# EAGLE board AlarmSt (EAGLE 4.16)
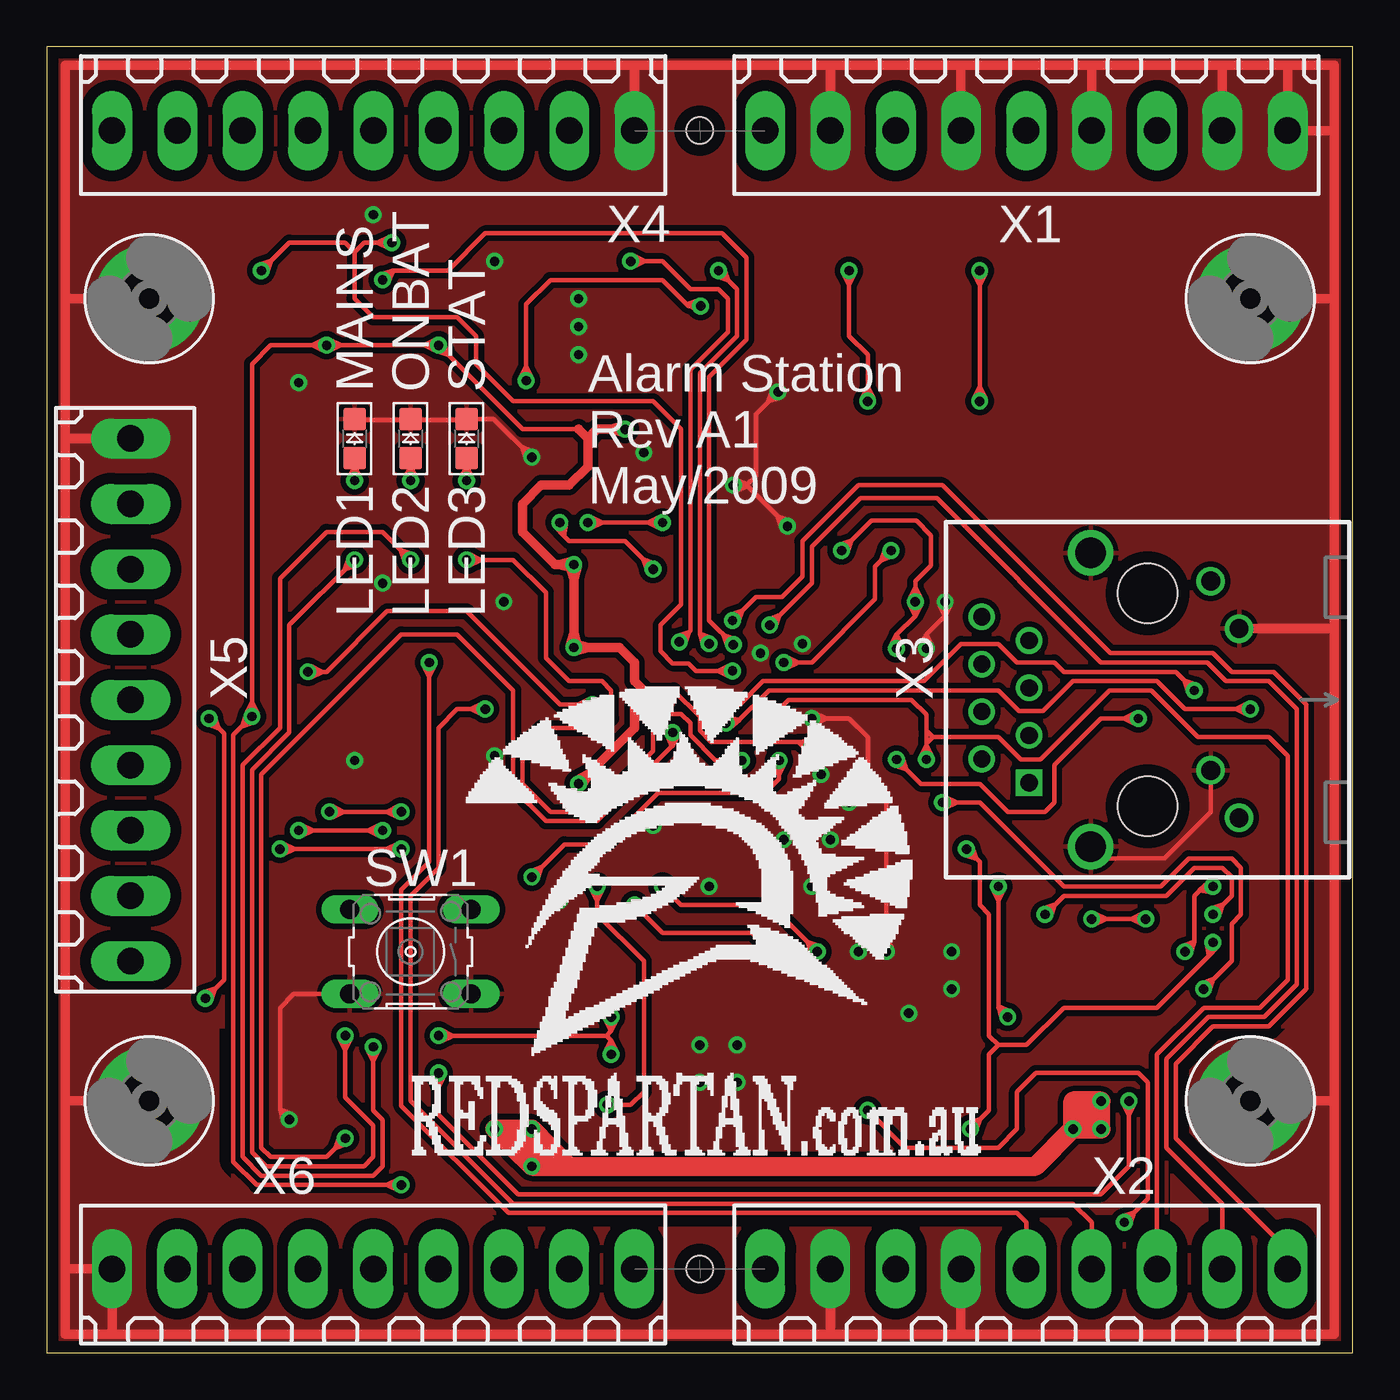
[diagram p4: board, top side]
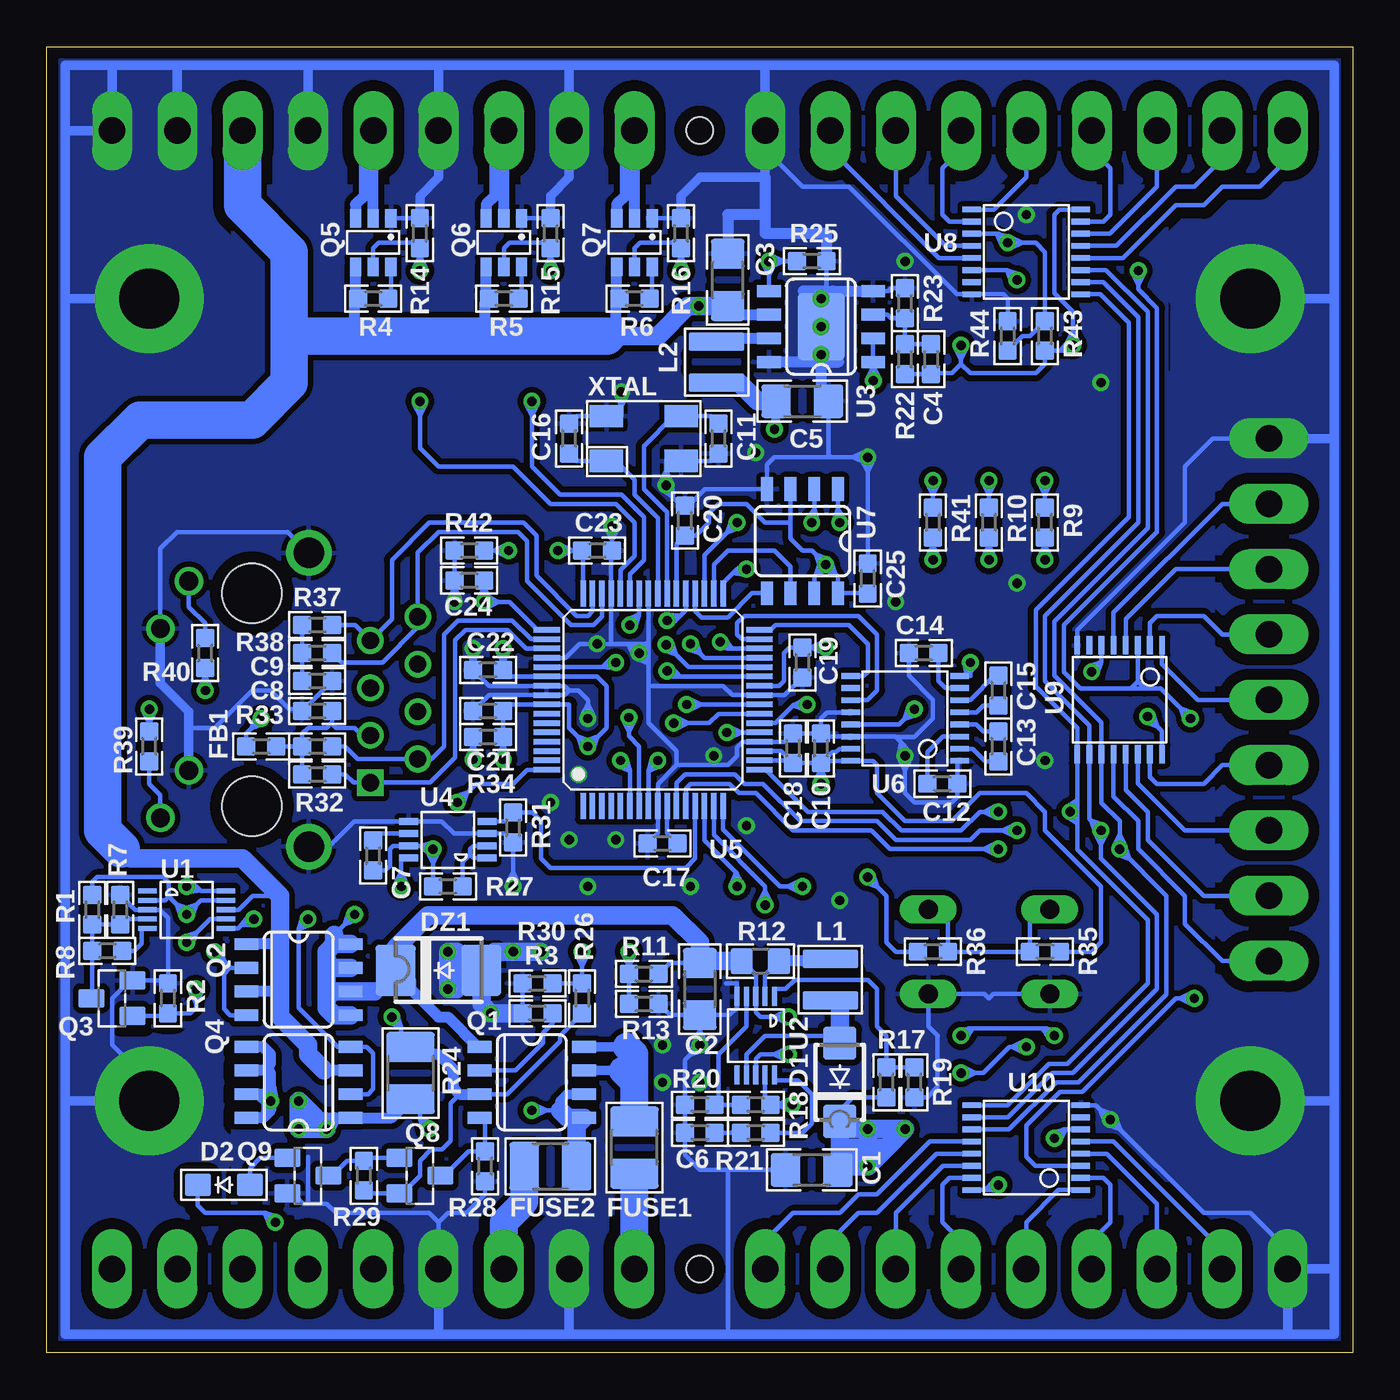
[diagram p5: board, bottom side, seen from below]

Size 70 x 70 mm. Coordinates in mm from the lower left corner, seen from the top.
Outline: 0,0 70,0 70,70 0,70 0,0
Copper layers (1*16): Top 0.035mm / dielectric 1.5mm / Bottom 0.035mm
Design rules "default": minimum track width 0.25mm, minimum drill 0.5mm, track to track 8mil, track to pad 8mil, pad to pad 8mil, via to via 8mil, smd to smd 0mil, copper to edge 25mil, drill to drill 8mil, minimum pad ring 10mil, minimum via ring 8mil, stop-mask expansion 3mil, vias tented up to drill 0.5mm, thermal gap 10mil
Net classes: 3 POWER: width 0.2 mm
Holes 1.42 mm at 35,65.5 35,4.5

## Footprints (pad centres in the part's own frame; a part is rotated, then mirrored left to right if it is on the bottom)
1206 = smd 1.6 x 1.8: 1 -1.4,0; 2 1.4,0
0603 = smd 1 x 1: 1 -0.8,0; 2 0.8,0
SMA = smd 1.8 x 1.8: A 2.1,0; K -2.1,0
SOD323 = smd 1.4 x 1.2: A 1.4,0; K -1.4,0
SMB = smd 2.159 x 2.743: A 2.3,0; K -2.3,0
1210 = smd 1.6 x 2.6: 1 -1.4,0; 2 1.4,0
MOUNTING-HOLE-3.2MM = drill 3.2 pad 5.842 round: VIA 0,0
VLS3015 = smd 3 x 1: 1 0,1.1; 2 0,-1.1
LED0805 = smd 1.2 x 1.2: A -1.05,0; K 1.05,0
SO08 = smd 0.635 x 1.27: 1 -1.905,-2.794; 2 -0.635,-2.794; 3 0.635,-2.794; 4 1.905,-2.794; 5 1.905,2.794; 6 0.635,2.794; 7 -0.635,2.794; 8 -1.905,2.794
SOT23 = smd 1 x 1.4: 1 -0.95,-1.1; 2 0.95,-1.1; 3 0,1.1
SSOT6 = smd 0.6 x 1: 1 -0.95,-1.3; 2 0,-1.3; 3 0.95,-1.3; 4 0.95,1.3; 5 0,1.3; 6 -0.95,1.3
0805 = smd 1.2 x 1.4: 1 -1,0; 2 1,0
BUTTON-B3F-10XX = drill 1.016 long: 1 -3.251,2.261; 2 3.251,2.261; 3 -3.251,-2.261; 4 3.251,-2.261
MSOP10 = smd 0.28 x 1: 1 -1,-2.1; 2 -0.5,-2.1; 3 0,-2.1; 4 0.5,-2.1; 5 1,-2.1; 6 1,2.1; 7 0.5,2.1; 8 0,2.1; 9 -0.5,2.1; 10 -1,2.1
SO08E = smd 0.635 x 1.27: 1 -1.905,-2.794; 2 -0.635,-2.794; 3 0.635,-2.794; 4 1.905,-2.794; 5 1.905,2.794; 6 0.635,2.794; 7 -0.635,2.794; 8 -1.905,2.794 | smd 3.6 x 2.5: E 0,0
MSOP8 = smd 0.38 x 1: 1 -0.975,-2.1; 2 -0.325,-2.1; 3 0.325,-2.1; 4 0.975,-2.1; 5 0.975,2.1; 6 0.325,2.1; 7 -0.325,2.1; 8 -0.975,2.1
TQFP64 = smd 1.4 x 0.29: 1 -5.7,3.75; 2 -5.7,3.25; 3 -5.7,2.75; 4 -5.7,2.25; 5 -5.7,1.75; 6 -5.7,1.25; 7 -5.7,0.75; 8 -5.7,0.25; 9 -5.7,-0.25; 10 -5.7,-0.75; 11 -5.7,-1.25; 12 -5.7,-1.75; 13 -5.7,-2.25; 14 -5.7,-2.75; 15 -5.7,-3.25; 16 -5.7,-3.75; 33 5.7,-3.75; 34 5.7,-3.25; 35 5.7,-2.75; 36 5.7,-2.25; 37 5.7,-1.75; 38 5.7,-1.25; 39 5.7,-0.75; 40 5.7,-0.25; 41 5.7,0.25; 42 5.7,0.75; 43 5.7,1.25; 44 5.7,1.75; 45 5.7,2.25; 46 5.7,2.75; 47 5.7,3.25; 48 5.7,3.75 | smd 0.29 x 1.4: 17 -3.75,-5.7; 18 -3.25,-5.7; 19 -2.75,-5.7; 20 -2.25,-5.7; 21 -1.75,-5.7; 22 -1.25,-5.7; 23 -0.75,-5.7; 24 -0.25,-5.7; 25 0.25,-5.7; 26 0.75,-5.7; 27 1.25,-5.7; 28 1.75,-5.7; 29 2.25,-5.7; 30 2.75,-5.7; 31 3.25,-5.7; 32 3.75,-5.7; 49 3.75,5.7; 50 3.25,5.7; 51 2.75,5.7; 52 2.25,5.7; 53 1.75,5.7; 54 1.25,5.7; 55 0.75,5.7; 56 0.25,5.7; 57 -0.25,5.7; 58 -0.75,5.7; 59 -1.25,5.7; 60 -1.75,5.7; 61 -2.25,5.7; 62 -2.75,5.7; 63 -3.25,5.7; 64 -3.75,5.7
TSSOP16 = smd 0.305 x 0.991: 1 -2.275,-2.918; 2 -1.625,-2.918; 3 -0.975,-2.918; 4 -0.325,-2.918; 5 0.325,-2.918; 6 0.975,-2.918; 7 1.625,-2.918; 8 2.275,-2.918; 9 2.275,2.918; 10 1.625,2.918; 11 0.975,2.918; 12 0.325,2.918; 13 -0.325,2.918; 14 -0.975,2.918; 15 -1.625,2.918; 16 -2.275,2.918
180-9 = drill 1.422 long: 1 -14,0; 2 -10.5,0; 3 -7,0; 4 -3.5,0; 5 0,0; 6 3.5,0; 7 7,0; 8 10.5,0; 9 14,0
PULSE-PJ-J0 = drill 0.914 square: 1 4.445,-6.35 | drill 0.914 round: 2 3.175,-8.89; 3 1.905,-6.35; 4 0.635,-8.89; 5 -0.635,-6.35; 6 -1.905,-8.89; 7 -3.175,-6.35; 8 -4.445,-8.89 | drill 1.016 round: 9 6.325,4.902; 10 3.785,3.378; 11 -3.81,4.902; 12 -6.35,3.378 | drill 1.626 round: S1 -7.874,-3.048; S2 7.874,-3.048 | hole 3.2: -5.715,0; 5.715,0
ABM3B = smd 1.8 x 1.2: 1 -2,-1.2; 2 2,-1.2; 3 2,1.2; 4 -2,1.2

## Placement (x,y rotation side)
C1  10uF/25V  [1206]  29,9.8 0 bottom
C2  10uF/25V  [1206]  35,19.5 90 bottom
C3  10uF/25V  [1206]  33.5,57.5 270 bottom
C4  4.7nF  [0603]  22.6,53.25 270 bottom
C5  22u/10V  [1206]  29.5,51 180 bottom
C6  10nF  [0603]  35,11.8 0 bottom
C7  0.1uF  [0603]  52.5,26.65 90 bottom
C8  0.1uF  [0603]  55.5,34.4 0 bottom
C9  0.1uF  [0603]  55.5,36 180 bottom
C10  1uF  [0603]  28.5,32.4 90 bottom
C11  33pF  [0603]  34,49 90 bottom
C12  0.1uF  [0603]  22,30.5 180 bottom
C13  0.1uF  [0603]  19,32.5 270 bottom
C14  0.1uF  [0603]  23,37.5 0 bottom
C15  0.1uF  [0603]  19,35.5 270 bottom
C16  33pF  [0603]  42,49 270 bottom
C17  1uF  [0603]  37,27.3 0 bottom
C18  1uF  [0603]  30,32.4 270 bottom
C19  1uF  [0603]  29.5,37 90 bottom
C20  1uF  [0603]  35.8,44.6 270 bottom
C21  1uF  [0603]  46.35,34.4 0 bottom
C22  1uF  [0603]  46.35,36.6 0 bottom
C23  1uF  [0603]  40.5,43 180 bottom
C24  1uF  [0603]  47.35,41.4 0 bottom
C25  1uF  [0603]  26,41.5 270 bottom
D1  STPS1L40  [SMA]  27.5,14.5 90 bottom
D2  RB751V40T1  [SOD323]  60.5,9 0 bottom
DZ1  SMBJ16A  [SMB]  49,20.5 0 bottom
FB1  60R  [0603]  58.5,32.5 0 bottom
FUSE1  2Amp  [1210]  38.5,11 90 bottom
FUSE2  2Amp  [1210]  43,10 0 bottom
HOLE1  remove  [MOUNTING-HOLE-3.2MM]  5.5,56.5 0 top
HOLE2  remove  [MOUNTING-HOLE-3.2MM]  64.5,56.5 0 top
HOLE3  remove  [MOUNTING-HOLE-3.2MM]  5.5,13.5 0 top
HOLE4  remove  [MOUNTING-HOLE-3.2MM]  64.5,13.5 0 top
L1  10uH  [VLS3015]  28,20 0 bottom
L2  3.3uH  [VLS3015]  34.1,53.1 0 bottom
LED1  Green  [LED0805]  16.5,49 90 top
LED2  Red  [LED0805]  19.5,49 90 top
LED3  Orange  [LED0805]  22.5,49 90 top
LOGO1  LOGO-REDSPARTAN-2  [LOGO-REDSPARTAN-2]  19.5,10.5 0 top
Q1  AO4805  [SO08]  44,14.5 270 bottom
Q2  AO4805  [SO08]  56.5,20 270 bottom
Q3  FDV301N  [SOT23]  66.5,19 90 bottom
Q4  AO4805  [SO08]  56.5,14.5 90 bottom
Q5  SI3861  [SSOT6]  52.5,59.5 180 bottom
Q6  SI3861  [SSOT6]  45.5,59.5 180 bottom
Q7  SI3861  [SSOT6]  38.5,59.5 180 bottom
Q8  BSS84  [SOT23]  50,9.5 270 bottom
Q9  DDTA143ZCA  [SOT23]  56,9.5 270 bottom
R1  115K  [0603]  67.55,23.75 90 bottom
R2  10K  [0603]  63.5,19 270 bottom
R3  10K  [0603]  43.7,18.2 0 bottom
R4  10K  [0603]  52.5,56.5 180 bottom
R5  10K  [0603]  45.5,56.5 180 bottom
R6  10K  [0603]  38.5,56.5 180 bottom
R7  49K9  [0603]  66.05,23.75 270 bottom
R8  287K  [0603]  66.75,21.55 180 bottom
R9  2K  [0603]  16.5,44.5 270 bottom
R10  2K  [0603]  19.5,44.5 270 bottom
R11  15K 1%  [0603]  38,20.3 0 bottom
R12  0.1R  [0805]  31.75,21 0 bottom
R13  3K9 1%  [0603]  38,18.7 180 bottom
R14  10K  [0603]  50,60 270 bottom
R15  10K  [0603]  43,60 270 bottom
R16  10K  [0603]  36,60 270 bottom
R17  1M33 1%  [0603]  25,14.5 270 bottom
R18  6K8  [0603]  32,13.3 180 bottom
R19  137K 1%  [0603]  23.5,14.5 90 bottom
R20  1K5  [0603]  35,13.3 0 bottom
R21  2K  [0603]  32,11.8 0 bottom
R22  7K5 1%  [0603]  24,53.25 270 bottom
R23  2K4 1%  [0603]  24,56.25 270 bottom
R24  0.02R  [1210]  50.5,15 270 bottom
R25  10K  [0603]  29,58.5 180 bottom
R26  15K 1%  [0603]  41.3,19 270 bottom
R27  30R 1%  [0603]  48.5,25 180 bottom
R28  10K  [0603]  46.5,10 90 bottom
R29  10K  [0603]  53,9.5 270 bottom
R30  3K9 1%  [0603]  43.7,19.8 0 bottom
R31  10K 1%  [0603]  45,28.15 90 bottom
R32  49R9 1%  [0603]  55.5,31 180 bottom
R33  49R9 1%  [0603]  55.5,32.5 180 bottom
R34  10K  [0603]  46.35,33 0 bottom
R35  10K  [0603]  16.5,21.5 0 bottom
R36  680R  [0603]  22.5,21.5 0 bottom
R37  49R9 1%  [0603]  55.5,39 0 bottom
R38  49R9 1%  [0603]  55.5,37.5 0 bottom
R39  180R  [0603]  64.5,32.5 90 bottom
R40  180R  [0603]  61.5,37.5 270 bottom
R41  680R  [0603]  22.5,44.5 270 bottom
R42  2K26 1%  [0603]  47.35,43 0 bottom
R43  1K6  [0603]  16.5,54.5 270 bottom
R44  15K  [0603]  18.5,54.5 270 bottom
SW1  Confirm  [BUTTON-B3F-10XX]  19.5,21.5 180 top
U1  LTC4416  [MSOP10]  62.5,23.75 270 bottom
U2  LT1618  [MSOP10]  32,17 180 bottom
U3  ST1S10  [SO08E]  28.5,55 90 bottom
U4  LTC6102  [MSOP8]  48.5,27.5 90 bottom
U5  PIC18F67J60  [TQFP64]  37.5,35 90 bottom
U6  MAX3221  [TSSOP16]  24,34 90 bottom
U7  25AA1024  [SO08]  29.5,43.5 180 bottom
U8  SN74HC4851PW  [TSSOP16]  17.5,59 270 bottom
U9  SN74HC4851PW  [TSSOP16]  12.5,35 180 bottom
U10  SN74HC4851PW  [TSSOP16]  17.5,11 90 bottom
X1  1945164  [180-9]  52.5,65.5 180 top
X2  1945164  [180-9]  52.5,4.5 0 top
X3  PULSE-J0026  [PULSE-PJ-J0]  59,35 270 top
X4  1945164  [180-9]  17.5,65.5 180 top
X5  1945164  [180-9]  4.5,35 270 top
X6  1945164  [180-9]  17.5,4.5 0 top
XTAL  25MHz  [ABM3B]  38,49 0 bottom

## Tracks (layer width: path | path; a pad name or v marks a point on that pad's centre or on a via)
2V5
  Bottom 0.25: U5.10 36.75,27.85 C17.2
3V3  (via drill 0.5)
  Top 0.25: 28.5,49.5 25.5,49.5 v21,54 | v15,54 12,54 11,53 v11,34.1 | v19,9 12,9 11.25,9 10,10.25 10,33.1 v11,34.1 | v58.5,34 56.5,34 54,31.5 54,29.5 53.5,29 51.5,29 50,30.5 46.85,30.5 v45.55,31.8 | v45.55,37.75 45.55,38.5 | 45.55,38.5 46.55,39.5 | 46.55,39.5 v46.55,40.25 | v42.6,43 44.2,44.6 46.6,44.6 47.4,43.8 47.4,42.2 46.55,41.35 v46.55,40.25 | v15,54 v21,54 | v41,32.5 40.75,32.75 39.85,32.75 39.25,32.75 36.25,32.75 35.6,32.75 35,33.35 35,34.1 33.6,35.5 32,35.5 | v15,54 14.86,53.7 14.25,54 14.86,54.3 v15,54 | v15,54 15.14,54.3 15.75,54 15.14,53.7 v15,54 | v11,34.1 10.71,34.24 11,34.85 11.29,34.24 v11,34.1 | v11,34.1 11.11,33.79 10.47,33.57 10.69,34.21 v11,34.1 | v19,9 18.86,8.71 18.25,9 18.86,9.29 v19,9 | v21,54 21.31,54.11 21.53,53.47 20.89,53.69 v21,54 | v21,54 20.86,53.7 20.25,54 20.86,54.3 v21,54 | v58.5,34 58.36,33.7 57.75,34 58.36,34.3 v58.5,34 | v45.55,31.8 45.86,31.91 46.08,31.27 45.44,31.49 v45.55,31.8 | v41,32.5 40.77,32.27 40.29,32.75 40.96,32.83 v41,32.5 | 46.55,39.5 46.84,40.11 v46.55,40.25 | 46.55,39.5 46.26,40.11 v46.55,40.25 | v46.55,40.25 46.26,40.39 46.55,41 46.84,40.39 v46.55,40.25 | 45.55,38.5 45.26,37.89 v45.55,37.75 | 45.55,38.5 45.84,37.89 v45.55,37.75 | v42.6,43 42.49,43.31 43.13,43.53 42.91,42.89 v42.6,43
  Top 0.5: 28.5,49.5 29,49 | 29,49 29.5,49.5 v31,49.5 | 29,49 29,47.5 28,46.5 26.5,46.5 25.5,45.5 25.5,44 27.25,42.25 v28.25,42.25 | v28.25,42.25 v28.25,37.8 | v28.25,37.8 30.7,37.8 31.5,37 31.5,36 32,35.5 31.5,35 31.5,33.5 v28.5,30.5 | v31,49.5 30.95,49.3 30.25,49.5 30.95,49.7 v31,49.5 | v28.25,37.8 28.05,37.85 28.25,38.55 28.45,37.85 v28.25,37.8 | v28.25,37.8 28.3,37.99 29,37.8 28.3,37.6 v28.25,37.8 | v28.25,42.25 28.45,42.2 28.25,41.5 28.05,42.2 v28.25,42.25 | v28.25,42.25 28.2,42.05 27.5,42.25 28.2,42.45 v28.25,42.25 | v28.5,30.5 28.4,30.68 29.03,31.03 28.68,30.4 v28.5,30.5
  Bottom 0.25: U5.38 36.25,43.35 C20.2 35.2,43.8 34.5,44.5 34.5,45 34,45.5 32.5,45.5 31.5,44.5 30.14,44.5 | U5.19 30.65,32.25 C18.2 | U5.48 41.25,42.95 C23.2 v42.6,43 | U5.49 43.7,38.75 45.2,40.25 v46.55,40.25 | 30.14,44.5 U7.3 | U6.15 27.52,32.38 27.7,32.2 27.9,32.2 28.48,31.62 | C10.1 C18.2 | 28.48,31.62 28.4,31.7 28.4,31.73 U6.16 25.73,31.73 25.5,31.5 25.5,30 24,28.5 21.5,28.5 20,30 17.5,30 16.5,29 16.5,28 13.5,25 13.5,22 14,21.5 R35.2 | C10.1 28.48,31.62 | v28.25,42.25 27.59,41.59 U7.8 C25.2 | R22.2 C4.2 22.6,52.5 21.5,52.5 21,53 | 21,53 20.5,52.5 17,52.5 16.5,53 R43.2 15.3,53.7 v15,54 | U8.16 15.72,61.27 16,61 16,56.8 15,55.8 v15,54 | C5.2 30.9,49.6 v31,49.5 | U9.16 10.22,33.33 v11,34.1 | U5.26 30.75,35.75 30.5,36 30.5,37.5 30.2,37.8 C19.2 v28.25,37.8 | C18.2 30,31.75 U5.18 | v21,54 21,53 | v28.25,42.25 29,43 29.5,43 30.14,43.63 30.14,44.5 | U7.7 28.86,41.63 v28.25,42.25 | FB1.1 59.3,33.2 v58.5,34 | v45.55,31.8 R34.2 C21.2 45.2,34.75 U5.57 42,34.75 42,33.5 v41,32.5 | v28.5,30.5 C10.1 | v41,32.5 40,33.5 40,35.75 40.5,36.25 U5.54 45.2,36.25 C22.2 v45.55,37.75 | v46.55,40.25 C24.2 | U10.16 19.27,8.72 v19,9 | v31,49.5 30.69,49.6 30.9,50.24 31.27,49.68 v31,49.5 | v15,54 14.71,54.14 15,54.75 15.29,54.14 v15,54 | v15,54 15.25,54.21 15.69,53.7 15.01,53.67 v15,54 | v11,34.1 11.11,33.79 10.47,33.57 10.69,34.21 v11,34.1 | v19,9 19.24,9.22 19.7,8.72 19.02,8.67 v19,9 | v21,54 21.3,53.86 21,53.25 20.7,53.86 v21,54 | v28.25,37.8 28.39,38.09 29,37.8 28.39,37.51 v28.25,37.8 | v28.25,42.25 28.36,41.94 27.72,41.72 27.94,42.36 v28.25,42.25 | v28.25,42.25 28.14,42.56 28.78,42.78 28.56,42.14 v28.25,42.25 | v28.25,42.25 28.56,42.36 28.78,41.72 28.14,41.94 v28.25,42.25
  Bottom 0.25: v58.5,34 58.81,34.11 59.03,33.47 58.39,33.69 v58.5,34 | v45.55,31.8 45.26,31.94 45.55,32.55 45.84,31.94 v45.55,31.8 | v28.5,30.5 28.2,30.64 28.5,31.25 28.8,30.64 v28.5,30.5 | v41,32.5 40.69,32.39 40.47,33.03 41.11,32.81 v41,32.5 | v41,32.5 40.89,32.81 41.53,33.03 41.31,32.39 v41,32.5 | v46.55,40.25 46.26,40.39 46.55,41 46.84,40.39 v46.55,40.25 | v46.55,40.25 46.41,39.95 45.8,40.25 46.41,40.55 v46.55,40.25 | v45.55,37.75 45.84,37.61 45.55,37 45.26,37.61 v45.55,37.75 | v42.6,43 42.46,42.7 41.85,43 42.46,43.3 v42.6,43
  Bottom 1: L2.2 32.9,52 31.9,51 C5.2
12V  (via drill 0.5)
  Top 0.25: v62.5,23.5 63.5,24.5 63.5,25.5 63,26 61.5,26 60,24.5 54.5,24.5 v53.5,23.5 | 30,17 30.25,16.75 | 30.25,16.75 v30.25,16 | 30,17 30.25,17.25 | 30.25,17.25 v30.25,18 | v16.5,42.5 13,39 13,33.25 11,31.25 11,10.75 11.75,10 17,10 17.5,10.5 17.5,12.2 16,13.7 v16,17 | v21,17 30,17 | v62.5,23.5 62.39,23.81 63.03,24.03 62.81,23.39 v62.5,23.5 | v53.5,23.5 53.39,23.81 54.03,24.03 53.81,23.39 v53.5,23.5 | 30.25,16.75 29.95,16.14 v30.25,16 | 30.25,16.75 30.55,16.14 v30.25,16 | 30.25,17.25 30.55,17.86 v30.25,18 | 30.25,17.25 29.95,17.86 v30.25,18 | v16.5,42.5 16.61,42.19 15.97,41.97 16.19,42.61 v16.5,42.5 | v16,17 16.3,16.86 16,16.25 15.71,16.86 v16,17 | v21,17 21.14,17.3 21.75,17 21.14,16.7 v21,17
  Bottom 0.25: U1.9 61.75,24.25 v62.5,23.5 | v62.5,23.5 63.45,24.45 | 63.45,24.45 63.65,24.25 U1.2 | R12.1 32,20.25 U2.3 32,18.25 31.75,18 v30.25,18 | R1.2 67.55,25.25 67.3,25.5 63.75,25.5 63.45,25.2 63.45,24.45 | R11.2 36.6,20.9 C2.2 | 54.59,22.41 v53.5,23.5 | U2.8 32,15.75 31.75,16 v30.25,16 | v16.5,42.5 R9.2 | v16,17 16.4,17.4 20.6,17.4 v21,17 | v62.5,23.5 62.19,23.39 61.97,24.03 62.61,23.81 v62.5,23.5 | v62.5,23.5 62.39,23.81 63.03,24.03 62.81,23.39 v62.5,23.5 | v53.5,23.5 53.81,23.61 54.03,22.97 53.39,23.19 v53.5,23.5 | v30.25,16 30.39,16.3 31,16 30.39,15.71 v30.25,16 | v30.25,18 30.39,18.3 31,18 30.39,17.7 v30.25,18 | v16.5,42.5 16.2,42.64 16.5,43.25 16.8,42.64 v16.5,42.5 | v16,17 15.96,17.33 16.63,17.4 16.28,16.83 v16,17 | v21,17 20.72,16.83 20.37,17.4 21.04,17.33 v21,17
  Bottom 0.6: Q1.1 46.91,16.41 48.5,18 49,18 50.5,19.5 50.5,20 51.3,20.8 DZ1.K 52.44,19.36 | 35,21 C2.2
  Bottom 1: Q2.5 54.59,18.09 55,18.5 55,19 | 54.59,21.91 Q2.8 | 54.59,21.91 55,21.5 55,21 | 55,19 55,21 | Q2.7 54.63,20.64 55,21 | 55,19 54.63,19.36 Q2.6 52.44,19.36 | R12.1 35,21 35,22 36.45,23.45 49.55,23.45 51.3,21.7 DZ1.K | 54.59,21.91 54.59,22.41
12V_FUSED
  Bottom 0.5: 38.91,16.41 Q1.8 | 39.13,15.13 Q1.7
  Bottom 1.5: 38.91,16.41 38.5,16 38.5,14.5 | FUSE1.2 38.5,14.5 | 38.5,14.5 39.13,15.13
ADC_SENSE  (via drill 0.5)
  Top 0.25: v11.5,58 13,59.5 16,59.5 16.5,59 | 16.5,59 17,59.5 v18.5,59.5 | v36.75,36.55 36.15,36.55 34.8,36.55 34.4,36.95 33.55,36.95 32.9,37.6 32.9,39 34,40.1 34,49.5 32.5,51 25,51 23,53 23,54.5 22,55.5 17.5,55.5 16.5,56.5 16.5,59 | v8.5,19 9.5,20 9.5,20.5 9.5,33.2 v8.7,34 | v11.5,58 11.39,58.31 12.03,58.53 11.81,57.89 v11.5,58 | v18.5,59.5 18.36,59.2 17.75,59.5 18.36,59.8 v18.5,59.5 | v36.75,36.55 36.61,36.26 36,36.55 36.61,36.84 v36.75,36.55 | v8.5,19 8.39,19.31 9.03,19.53 8.81,18.89 v8.5,19 | v8.7,34 9.01,34.11 9.23,33.47 8.59,33.69 v8.7,34
  Bottom 0.25: U10.3 17.02,10.03 17.5,10.5 17.5,12.2 15.7,14 14.5,14 9.5,19 v8.5,19 | 11.15,35.6 11.53,35.98 | v8.7,34 8.9,34.2 10.3,35.6 11.15,35.6 | 11.53,35.98 U9.3 | 11.53,35.98 11.9,35.6 | 11.9,35.6 14.6,35.6 15.5,36.5 15.5,39 10.5,44 10.5,56 11.5,57 v11.5,58 | 11.15,35.6 11.9,35.6 | U8.3 18.98,59.98 v18.5,59.5 | v18.5,59.5 17,59.5 16.5,59 R43.1 17.3,54.5 17.7,54.5 R44.2 | v36.75,36.55 36.45,36.25 U5.27 | v11.5,58 11.79,57.86 11.5,57.25 11.21,57.86 v11.5,58 | v18.5,59.5 18.42,59.82 19.08,59.98 18.8,59.36 v18.5,59.5 | v18.5,59.5 18.36,59.2 17.75,59.5 18.36,59.8 v18.5,59.5 | v36.75,36.55 36.74,36.22 36.06,36.25 36.5,36.76 v36.75,36.55 | v8.5,19 8.64,19.3 9.25,19 8.64,18.7 v8.5,19 | v8.7,34 8.59,34.31 9.23,34.53 9.01,33.89 v8.7,34
CHARGER_SHDN  (via drill 0.5)
  Top 0.25: v29.5,25 29.5,23.5 32,21 32,14 31.3,13.3 v30.05,13.3 | v30.05,13.3 30.19,13.6 30.8,13.3 30.19,13.01 v30.05,13.3 | v29.5,25 29.8,24.86 29.5,24.25 29.2,24.86 v29.5,25
  Bottom 0.25: U2.9 31.5,13.6 R18.1 v30.05,13.3 | U5.16 33.75,28.05 33.6,27.9 30.7,25 v29.5,25 | v30.05,13.3 30.19,13.6 30.8,13.3 30.19,13.01 v30.05,13.3 | v29.5,25 29.64,25.3 30.25,25 29.64,24.7 v29.5,25
CONFIRM  (via drill 0.5)
  Top 0.25: v39.25,31.75 39.25,30.75 38.5,30 37.5,30 32.75,30 30,27.25 27.75,27.25 v26,25.5 | v39.25,31.75 39.55,31.61 39.25,31 38.95,31.61 v39.25,31.75 | v26,25.5 25.89,25.81 26.53,26.03 26.31,25.39 v26,25.5
  Bottom 0.25: R36.1 24.5,21.5 25,22 25,24.5 v26,25.5 | U5.6 38.75,31.25 v39.25,31.75 | v39.25,31.75 39.37,31.45 38.75,31.19 38.93,31.84 v39.25,31.75 | v26,25.5 26.11,25.19 25.47,24.97 25.69,25.61 v26,25.5
E_CS  (via drill 0.5)
  Top 0.25: v32.5,42 31.5,43 31,43.5 28,43.5 27.5,44 v27.5,44.5 | v27.5,44.5 27.82,44.45 27.72,43.78 27.26,44.28 v27.5,44.5 | v32.5,42 32.19,41.89 31.97,42.53 32.61,42.31 v32.5,42
  Bottom 0.25: U7.1 27.59,44.59 v27.5,44.5 | U5.33 33.75,41.25 33,42 v32.5,42 | v27.5,44.5 27.23,44.68 27.59,45.24 27.81,44.6 v27.5,44.5 | v32.5,42 32.72,42.24 33.22,41.78 32.55,41.68 v32.5,42
EXT_VOLTAGE  (via drill 0.5)
  Top 0.25: v31.5,24 33,22.5 37.8,22.5 v38.8,21.5 | v31.5,24 31.81,24.11 32.03,23.47 31.39,23.69 v31.5,24 | v38.8,21.5 38.49,21.39 38.27,22.03 38.91,21.81 v38.8,21.5
  Bottom 0.25: R13.2 R11.1 v38.8,21.5 | v31.5,24 31.5,25 34.25,27.75 U5.15 | v31.5,24 31.2,24.14 31.5,24.75 31.8,24.14 v31.5,24 | v38.8,21.5 39.09,21.36 38.8,20.75 38.51,21.36 v38.8,21.5
GND  (via drill 0.5)
  Top 0.25: LED1.K 16.55,50 19.45,50 LED2.K 19.55,50 22.45,50 LED3.K 23.95,50.05 v26,48 | v39.2,51.5 38,50.3 38,47 37.5,46.5 | 37.5,46.5 v39.7,44.3 | v36.8,46.5 37.5,46.5 | SW1.2 13.24,19.24 12.5,18.5 12.5,13 v13,12.5 | v45,25 v45,21.5 | X3.10 62.38,28.98 59.9,26.5 56.58,26.5 X3.S2 | v41,34 43,34 44,33 44,30.5 45,29.5 v45,25 | v47.15,37.75 47.15,38.5 | 47.15,38.5 48.15,39.5 | 48.15,39.5 v48.15,40.25 | v26,48 25.69,47.89 25.47,48.53 26.11,48.31 v26,48 | v36.8,46.5 36.92,46.8 37.55,46.55 36.96,46.22 v36.8,46.5 | v36.8,46.5 36.96,46.78 37.55,46.45 36.92,46.2 v36.8,46.5 | v39.2,51.5 39.31,51.19 38.67,50.97 38.89,51.61 v39.2,51.5 | v39.7,44.3 39.39,44.19 39.17,44.83 39.81,44.61 v39.7,44.3 | v13,12.5 12.68,12.41 12.5,13.06 13.12,12.8 v13,12.5 | v45,25 45.3,24.86 45,24.25 44.7,24.86 v45,25 | v45,25 44.7,25.14 45,25.75 45.3,25.14 v45,25 | v45,21.5 44.7,21.64 45,22.25 45.3,21.64 v45,21.5 | v41,34 41.14,34.3 41.75,34 41.14,33.7 v41,34 | 48.15,39.5 48.45,40.11 v48.15,40.25 | 48.15,39.5 47.85,40.11 v48.15,40.25 | 47.15,38.5 46.85,37.89 v47.15,37.75 | 47.15,38.5 47.45,37.89 v47.15,37.75
  Top 0.5: 69,38.81 X3.11 | 69,56.5 HOLE2.VIA | 69,56.5 69,65.5 | 69,65.5 69,69 66.5,69 | 66.5,69 X1.1 69,65.5 | 66.5,69 63,69 | 63,69 X1.2 | 56,69 63,69 | 56,69 X1.4 | 49,69 56,69 | 49,69 X1.6 | 42,69 49,69 | 42,69 X1.8 | 31.5,69 42,69 | 31.5,69 X4.1 | 31.5,69 1,69 1,56.5 | 1,56.5 HOLE1.VIA | 1,49 1,56.5 | 1,49 X5.1 | 1,13.5 1,49 | 1,13.5 HOLE3.VIA | 1,4.5 1,13.5 | 1,4.5 X6.1 3.5,1 | 1,4.5 1,1 3.5,1 | 3.5,1 42,1 | 42,1 X2.2 | 42,1 49,1 | 49,1 X2.4 | 49,1 69,1 69,13.5 | 69,13.5 HOLE4.VIA | 69,13.5 69,38.81 | 69,38.81 69,56.5
  Bottom 0.25: C21.1 46.3,35.25 U5.56 42.25,35.25 42,35.5 | C17.1 37.25,27.85 U5.9 37.25,30.5 36.25,31.5 | C9.1 C8.1 56.4,34.5 57,34.5 58,35.5 59,35.5 61,33.5 62.38,33.5 | 37.75,38 37.75,37.25 37.75,37 37.75,35.75 | 37.75,35.75 37.75,35.5 | 37.75,35.75 37.75,35.5 | 37.75,38 U5.41 | 37.75,35.75 37.75,35.5 | 37.75,35.75 36.85,35.75 35.6,35.75 33.75,35.75 33.25,35.25 U5.25 30.45,35.25 C19.1 | 39.75,38 37.75,38 | 39.75,38 41.45,38 42.2,37.25 U5.52 | R16.1 Q7.1 | R15.1 Q6.1 | R14.1 Q5.1 | 36.25,31.5 33.5,31.5 33,32 33,32.45 32.7,32.75 U5.20 30.45,32.75 C18.1 C10.2 | 36.25,31.5 36.25,32.25 37.75,33.75 37.75,35.5 | 39.75,38 U5.45 39.75,42.95 C23.1 v39.7,44.3 | 42,35.5 42.25,35.75 U5.55 46.3,35.75 C22.1 v47.15,37.75 | C10.2 28.32,33.02 U6.14 24.52,33.02 24.5,33 | U6.12 28.18,34.33 28.5,34 C10.2 | U6.1 21.2,31.73 C12.1 21.2,29.8 21.5,29.5 23.5,29.5 24,30 24,32.5 24.5,33 | X2.4 49,7 | 49,7 48.5,7.5 47.5,7.5 46.5,8.5 R28.1 | U3.4 24.89,56.91 24.75,57.05 R23.1 | C2.1 33.4,18.1 33,18.5 U2.5 33,19.8 33.6,19.8 | v35,16.5 35.8,15.7 R20.1 C6.1 35.8,10.6 35,9.8 33.5,9.8 | v35,16.5 C2.1 | 33.5,9.8 C1.1 | 65.25,23.75 U1.3 | 65.25,23.75 R7.1 | 65.25,23.75 63.95,23.75 63.5,23.3 R2.1 63.65,19.95 Q3.2 65.55,19.95 66.5,19 66.5,16.5 64.5,14.5 HOLE4.VIA | U9.8 14.78,38.73 9,44.5 9,47.5 7.5,49 X5.1 | U10.8 13.78,13.28 v13,12.5 | v13,12.5 8,7.5 5.5,7.5 3.5,5.5 X6.1 | 31.5,64.5 29.5,62.5 27,62.5 21.23,56.73 U8.8 18.73,56.73 18.5,56.5 R44.1 | X3.S1 57.08,44 63,44 63.9,43.1 X3.11 | 49,7 49.5,7.5 54.5,7.5 55,8 56,8 | Q9.2 56.8,8.55 56.25,8 56,8 | 35.8,45.2 C20.1 | 35.8,45.2 34.71,46.29 U7.4 31.41,47.59 31,48 28,48 | 28,48 v26,48 | v26,48 C25.1 | R42.1 C24.1 v48.15,40.25
  Bottom 0.25: R25.1 28.2,56.8 v28.5,56.5 | C11.1 | C11.1 34.1,48.1 34.4,47.8 XTAL.2 36.8,47.8 v36.8,46.5 | C16.1 | C16.1 41.9,49.9 41.6,50.2 XTAL.4 39.2,50.2 v39.2,51.5 | C5.1 28.1,48.1 28,48 | SW1.2 19.26,19.24 19.5,19 19.74,19.24 SW1.1 22.75,17.5 22.25,17 | R3.1 R30.1 | C2.1 36.6,18.1 R13.1 | C14.1 23.8,36.3 22.5,35 22.5,34 23.5,33 24.5,33 | 33.5,1 33.5,9.8 | 22.25,17 22.25,14.25 22.8,13.7 R19.1 | 35.8,45.2 36.8,46.2 v36.8,46.5 | v45,25 R31.1 45.48,27.82 U4.3 48.17,27.82 48.83,28.48 U4.5 53.52,28.48 54.87,27.13 X3.S2 | DZ1.A 46.7,20.8 46,21.5 | 42,35.5 41.5,35.5 41,35 v41,34 | 22.25,17 | 37.75,35.75 37.75,35.5 | 56,8 56,10.5 | v26,48 26.14,48.3 26.75,48 26.14,47.7 v26,48 | v26,48 26.3,47.86 26,47.25 25.7,47.86 v26,48 | v36.8,46.5 36.51,46.64 36.8,47.25 37.09,46.64 v36.8,46.5 | v36.8,46.5 36.99,46.23 36.44,45.84 36.47,46.52 v36.8,46.5 | v39.2,51.5 39.49,51.36 39.2,50.75 38.91,51.36 v39.2,51.5 | v39.7,44.3 39.99,44.16 39.7,43.55 39.41,44.16 v39.7,44.3 | v13,12.5 13.11,12.19 12.47,11.97 12.69,12.61 v13,12.5 | v13,12.5 12.89,12.81 13.53,13.03 13.31,12.39 v13,12.5 | v45,25 44.7,25.14 45,25.75 45.3,25.14 v45,25 | v41,34 40.7,34.14 41,34.75 41.3,34.14 v41,34 | v48.15,40.25 47.85,40.39 48.15,41 48.45,40.39 v48.15,40.25 | v47.15,37.75 47.45,37.61 47.15,37 46.85,37.61 v47.15,37.75 | v28.5,56.5 28.17,56.51 28.2,57.19 28.71,56.75 v28.5,56.5 | v38.25,37.5 38.37,37.2 37.75,36.94 37.93,37.59 v38.25,37.5 | v38.25,37.5 37.93,37.41 37.75,38.06 38.37,37.8 v38.25,37.5 | v38.25,37.5 38.16,37.82 38.81,38 38.55,37.38 v38.25,37.5 | v35,16.5 35.31,16.61 35.53,15.97 34.89,16.19 v35,16.5 | v35,16.5 34.7,16.64 35,17.25 35.3,16.64 v35,16.5
  Bottom 0.25: v24,32 23.76,32.22 24.22,32.72 24.32,32.05 v24,32 | v24,32 24.3,31.86 24,31.25 23.7,31.86 v24,32
  Bottom 0.406: v28.5,53.5 28.5,53.09 v28.5,53.5
  Bottom 0.5: 42,69 X1.8 42,63 43,62 R15.1 | 42,69 49,69 | 49,69 X1.6 49,63 50,62 R14.1 | X1.4 56,69 | 49,69 56,69 | X1.2 63,69 | 56,69 63,69 | 66.5,69 X1.1 69,65.5 | 66.5,69 63,69 | 31.5,69 1,69 1,56.5 | 31.5,69 42,69 | 1,4.5 1,1 3.5,1 | 1,4.5 1,13.5 | 1,13.5 1,49 | 1,49 1,56.5 | 3.5,1 33.5,1 42,1 | 42,1 49,1 | 49,1 69,1 69,13.5 | 69,13.5 69,56.5 | 69,56.5 69,65.5 | 69,65.5 69,69 66.5,69 | X3.10 62.38,33.5 62.38,34.38 63.9,35.9 X3.11 | HOLE4.VIA 69,13.5 | HOLE2.VIA 69,56.5 | HOLE1.VIA 1,56.5 | HOLE3.VIA 1,13.5 | X2.2 42,1 | X2.4 49,1 | 1,4.5 X6.1 3.5,1 | X5.1 1,49 | 31.5,69 X4.1 31.5,64.5 31.5,63 35,63 36,62 R16.1
  Bottom 0.6: 28.5,53.09 U3.8 | U3.E v28.5,53.5 | v28.5,53.5 28.5,53.09 | 28.5,56.91 U3.4 | v28.5,56.5 28.5,56.91 | v28.5,56.5 U3.E | v28.5,53.5 28.5,53.09 | v28.5,53.5 28.5,51.4 C5.1 | 28.5,56.91 29.45,56.91 | C3.1 33.5,61 31.5,61 | 31.5,61 31.5,60 28.2,60 R25.1 | 31.5,63 31.5,61 | 28.5,53.09 27.54,53.09 | 28.5,54.25 28.65,54.97 U3.E | 28.5,54.25 28.35,54.97 U3.E | 28.5,55.75 28.35,55.03 U3.E | 28.5,55.75 28.65,55.03 U3.E | v28.5,56.5 28.39,56.39 27.87,56.91 28.55,56.64 v28.5,56.5 | 28.5,55.75 28.65,56.47 v28.5,56.5 | 28.5,55.75 28.35,56.47 v28.5,56.5 | v28.5,56.5 28.45,56.64 29.13,56.91 28.61,56.39 v28.5,56.5 | v28.5,53.5 28.61,53.61 29.13,53.09 28.45,53.36 v28.5,53.5 | 28.5,54.25 28.35,53.53 v28.5,53.5 | 28.5,54.25 28.65,53.53 v28.5,53.5 | v28.5,53.5 28.65,53.47 28.5,52.75 28.35,53.47 v28.5,53.5 | v28.5,53.5 28.55,53.36 27.87,53.09 28.39,53.61 v28.5,53.5
  Bottom 1: R3.1 v46.2,18.2 46.7,18.7 DZ1.A 48.5,20.5 | 46,21.5 v45,21.5 v43.5,21.5 | 48.5,20.5 v48.5,19.5 48,19.5 48,21.5 v48.5,21.5 48.5,20.5
  other vias: 28.5,55 41.5,31 34.25,32 40.5,38 43,29.5 32.5,28.25 39.5,27.5 42,27.5 41,25 35.5,25 27.5,24.25 37,16.5 35,14.5 37,14.5 32,48.25 24.5,40.25 18,41.25 16.5,31.75 13.5,52 24,58.5 17.5,61
  pour Top (isolate 0.6, no thermals): 70,52.5 70,70 0,70 0,0 70,0 70,17.5 61,17.5 60,16.5 60,7.5 10,7.5 10,17.5 7.5,17.5 7.5,52.5 10,52.5 10,62.5 60,62.5 60,52.5
  pour Bottom (isolate 0.6, no thermals): 70,52.5 60,52.5 60,62.5 10,62.5 10,52.5 7.5,52.5 7.5,17.5 10,17.5 10,7.5 60,7.5 60,16.5 61,17.5 70,17.5 70,0 0,0 0,70 70,70
  pour Bottom (isolate 0.3): 70,52.5 60,52.5 60,62.5 10,62.5 10,52.5 7.5,52.5 7.5,17.5 10,17.5 10,7.5 60,7.5 60,16.5 61,17.5 70,17.5
  pour Top (isolate 0.3): 70,52.5 60,52.5 60,62.5 10,62.5 10,52.5 7.5,52.5 7.5,17.5 10,17.5 10,7.5 60,7.5 60,16.5 61,17.5 70,17.5
INH1  (via drill 0.5)
  Top 0.25: v36.8,37.95 35.5,39.25 35.5,52.3 37.5,54.3 37.5,58.7 36.2,60 23.5,60 21.5,58 18.5,58 v18,57.5 | v36.8,37.95 36.49,37.84 36.27,38.48 36.91,38.26 v36.8,37.95 | v18,57.5 17.91,57.82 18.56,58 18.3,57.38 v18,57.5
  Bottom 0.25: U5.28 35.6,36.75 v36.8,37.95 | U8.6 18.52,58.02 v18,57.5 | v36.8,37.95 36.91,37.64 36.27,37.42 36.49,38.06 v36.8,37.95 | v18,57.5 17.9,57.81 18.54,58.02 18.31,57.39 v18,57.5
INH2  (via drill 0.5)
  Top 0.25: v14,36.5 15,36.5 18.25,39.75 22.5,39.75 27.5,34.75 v29.25,34.75 | v29.25,34.75 29.11,34.45 28.5,34.75 29.11,35.05 v29.25,34.75 | v14,36.5 14.14,36.8 14.75,36.5 14.14,36.2 v14,36.5
  Bottom 0.25: U5.22 30.95,33.75 29.95,34.75 v29.25,34.75 | U9.6 13.47,37.02 v14,36.5 | v29.25,34.75 29.41,35.03 30,34.7 29.37,34.45 v29.25,34.75 | v14,36.5 13.69,36.4 13.47,37.04 14.11,36.81 v14,36.5
INH3  (via drill 0.5)
  Top 0.25: v33.55,33.25 33.55,32.55 29.5,28.5 26.75,28.5 25,30.25 25,35.5 22,38.5 19,38.5 11.5,31 11.5,11 12,10.5 15,10.5 v16,11.5 | v33.55,33.25 33.84,33.09 33.5,32.5 33.25,33.13 v33.55,33.25 | v16,11.5 16.11,11.19 15.47,10.97 15.69,11.61 v16,11.5
  Bottom 0.25: v33.55,33.25 U5.21 | U10.6 15.53,11.97 v16,11.5 | v33.55,33.25 33.41,32.95 32.8,33.25 33.41,33.55 v33.55,33.25 | v16,11.5 15.7,11.36 15.42,11.97 16.08,11.82 v16,11.5
LEDA  (via drill 0.5)
  Top 0.25: v35.7,34.75 37.15,34.75 38.4,36 47,36 49,38 51,38 52,37 54,37 54.5,36.5 60.5,36.5 v61.5,35.5 | v61.5,35.5 61.19,35.39 60.97,36.03 61.61,35.81 v61.5,35.5 | v35.7,34.75 35.84,35.05 36.45,34.75 35.84,34.45 v35.7,34.75
  Bottom 0.25: v61.5,35.5 R40.2 | U5.24 v35.7,34.75 | v61.5,35.5 61.2,35.64 61.5,36.25 61.8,35.64 v61.5,35.5 | v35.7,34.75 35.56,34.45 34.95,34.75 35.56,35.05 v35.7,34.75
LEDB  (via drill 0.5)
  Top 0.25: v36.4,33.75 36.95,33.75 38.7,35.5 51,35.5 52.1,34.4 53.4,34.4 55,36 59.5,36 61,34.5 v64.5,34.5 | v36.4,33.75 36.47,34.07 37.13,33.93 36.61,33.5 v36.4,33.75 | v64.5,34.5 64.36,34.2 63.75,34.5 64.36,34.8 v64.5,34.5
  Bottom 0.25: U5.23 34,34.25 34.5,33.75 v36.4,33.75 | v64.5,34.5 R39.2 | v36.4,33.75 36.26,33.45 35.65,33.75 36.26,34.05 v36.4,33.75 | v64.5,34.5 64.8,34.36 64.5,33.75 64.2,34.36 v64.5,34.5
MCLR  (via drill 0.5)
  Top 0.25: X2.7 59.5,16 62,18.5 65,18.5 66.5,20 66.5,32 65.5,33 61.7,33 59.2,35.5 56.95,35.5 53.25,31.8 52.2,31.8 51,33 47.5,33 | v38.8,34.05 39.75,35 46.35,35 47.15,34.2 47.15,33.35 | 47.15,32.65 R34.1 47.15,33.35 | 47.15,32.65 v47.15,31.8 | 47.5,33 47.15,33.35 | 47.5,33 47.15,32.65 | v38.8,34.05 38.69,34.36 39.33,34.58 39.11,33.94 v38.8,34.05 | v47.15,31.8 46.85,31.94 47.15,32.55 47.45,31.94 v47.15,31.8
  Bottom 0.25: v38.8,34.05 38.8,33.05 38.25,32.5 U5.7 | v47.15,31.8 R34.1 | v38.8,34.05 39.09,33.91 38.8,33.3 38.51,33.91 v38.8,34.05 | v47.15,31.8 46.85,31.94 47.15,32.55 47.45,31.94 v47.15,31.8
MUXA  (via drill 0.5)
  Top 0.25: v12.5,27 v19,27 | v19,27 18.86,26.7 18.25,27 18.86,27.3 v19,27 | v12.5,27 12.64,27.3 13.25,27 12.64,26.7 v12.5,27
  Bottom 0.25: U10.11 18.43,11.97 15.9,14.5 14.7,14.5 10,19.2 10,24.5 v12.5,27 | v12.5,27 12.5,28.5 13.47,29.48 U9.11 13.47,33.77 16,36.3 16,39.2 11,44.2 11,55.8 13.22,58.02 U8.11 | U5.12 35.75,30.25 35.5,30.5 33.4,30.5 32.9,30 32,30 30,28 25.8,28 24.8,27 v19,27 | v19,27 19.14,27.3 19.75,27 19.14,26.7 v19,27 | v12.5,27 12.61,26.69 11.97,26.47 12.19,27.11 v12.5,27 | v12.5,27 12.21,27.14 12.5,27.75 12.79,27.14 v12.5,27
MUXB  (via drill 0.5)
  Top 0.25: v13.5,28 v18,28 | v13.5,28 13.64,28.3 14.25,28 13.64,27.7 v13.5,28 | v18,28 17.86,27.7 17.25,28 17.86,28.3 v18,28
  Bottom 0.25: U10.10 18.48,12.62 16.1,15 15,15 10.5,19.5 10.5,23.5 13.5,26.5 v13.5,28 | U8.10 13.38,57.38 11.5,55.5 11.5,50.5 11.5,48.5 11.5,44.5 16.5,39.5 16.5,36 14.12,33.62 U9.10 14.12,28.62 v13.5,28 | U5.11 36.25,30.55 35.8,31 33.1,31 32.6,30.5 31.6,30.5 29.6,28.5 25.5,28.5 24.5,27.5 20.5,27.5 20,28 v18,28 | v13.5,28 13.79,27.86 13.5,27.25 13.21,27.86 v13.5,28 | v13.5,28 13.39,28.31 14.03,28.53 13.81,27.89 v13.5,28 | v18,28 18.14,28.3 18.75,28 18.14,27.7 v18,28
MUXC  (via drill 0.5)
  Top 0.25: v15.15,29 v19,29 | v19,29 18.86,28.7 18.25,29 18.86,29.3 v19,29 | v15.15,29 15.29,29.3 15.9,29 15.29,28.7 v15.15,29
  Bottom 0.25: U10.9 18.52,13.28 16.3,15.5 15.3,15.5 11,19.8 11,23.2 14.78,26.98 14.78,29 | 14.78,29 U9.9 14.78,33.48 17,35.7 17,39.8 12,44.8 12,48 12,50 12,55.2 13.53,56.73 U8.9 | U5.17 31.45,31.25 29.2,29 25.2,29 24.2,28 21,28 20,29 v19,29 | 14.78,29 v15.15,29 | v19,29 19.14,29.3 19.75,29 19.14,28.7 v19,29 | v15.15,29 15.33,28.73 14.78,28.35 14.82,29.02 v15.15,29 | v15.15,29 14.82,28.98 14.78,29.65 15.33,29.27 v15.15,29
N$1  (via drill 0.5)
  Top 0.25: v19.5,42.5 18,44 15,44 12.5,41.5 12.5,33.5 10.5,31.5 10.5,10.5 11.5,9.5 17.5,9.5 18,10 18,12.5 17.5,13 v17.5,16.4 | v21,15 21,12.75 25.25,8.5 56.5,8.5 58,10 v58,13.5 | v19.5,42.5 19.19,42.39 18.97,43.03 19.61,42.81 v19.5,42.5 | v17.5,16.4 17.8,16.26 17.5,15.65 17.2,16.26 v17.5,16.4 | v21,15 21.3,14.86 21,14.25 20.7,14.86 v21,15 | v58,13.5 58.3,13.36 58,12.75 57.7,13.36 v58,13.5
  Bottom 0.25: v19.5,42.5 R10.2 | v17.5,16.4 18.4,16.4 19.8,15 v21,15 | v19.5,42.5 19.2,42.64 19.5,43.25 19.8,42.64 v19.5,42.5 | v17.5,16.4 17.64,16.7 18.25,16.4 17.64,16.11 v17.5,16.4 | v21,15 20.86,14.71 20.25,15 20.86,15.29 v21,15
  Bottom 0.6: Q4.5 58.41,16.41 58,16 58,15.5 58.37,15.13 | 58.37,15.13 Q4.6 | 58.13,13.87 Q4.7 | 58.13,13.87 58,14 58,15 58.13,15.13 58.37,15.13 | Q4.8 58.41,12.6 58,13 v58,13.5 | v58,13.5 58.13,13.63 58.13,13.87 | v58,13.5 57.95,13.65 58.66,13.87 58.1,13.38 v58,13.5 | v58,13.5 57.85,13.53 58,14.25 58.15,13.53 v58,13.5 | v58,13.5 58.15,13.51 58.22,12.78 57.87,13.43 v58,13.5
N$2  (via drill 0.5)
  Top 0.25: v56,23.25 v58.9,23.25 | v56,23.25 56.14,23.55 56.75,23.25 56.14,22.95 v56,23.25 | v58.9,23.25 58.76,22.95 58.15,23.25 58.76,23.55 v58.9,23.25
  Bottom 0.25: Q4.2 52.78,13.87 52.5,14.15 52.5,16.05 52.85,16.41 Q4.4 54.41,16.41 56.5,18.5 56.5,22.75 v56,23.25 | v58.9,23.25 59.25,23.25 59.75,22.75 U1.6 | v56,23.25 56.32,23.34 56.5,22.69 55.88,22.95 v56,23.25 | v58.9,23.25 59.16,23.45 59.58,22.92 58.9,22.92 v58.9,23.25
N$3  (via drill 0.5)
  Top 0.25: v51.5,18 51,18.5 v51,25 | v51.5,18 51.18,17.91 51,18.56 51.62,18.3 v51.5,18 | v51,25 51.3,24.86 51,24.25 50.7,24.86 v51,25
  Bottom 0.25: R29.2 52.85,8.55 Q8.2 50.95,8.55 50,9.5 50,10.3 49.4,10.9 48.8,10.9 48.35,11.35 48.35,13.38 47.87,13.87 | Q1.3 45.34,13.87 42.5,16.7 42.5,17 R26.2 | R24.1 51,16.4 51,17.5 v51.5,18 | U4.8 51,26.52 v51,25 | v51.5,18 51.62,17.7 51,17.44 51.18,18.09 v51.5,18 | v51,25 50.7,25.14 51,25.75 51.3,25.14 v51,25
  Bottom 0.6: Q1.3 47.87,13.87 48.2,14.2 48.2,15.2 49,16 50.5,16 R24.1
N$4  (via drill 0.5)
  Top 0.25: v61,21.5 61.5,22 61.5,24.5 62,25 v62.5,25 | v61,21.5 60.88,21.8 61.5,22.06 61.32,21.41 v61,21.5 | v62.5,25 62.45,24.68 61.78,24.78 62.28,25.24 v62.5,25
  Bottom 0.25: 60.13,20.64 Q2.2 | Q2.4 60.16,18.09 60.5,18.44 60.5,20.32 60.19,20.64 60.13,20.64 | U1.10 61.75,24.75 62,25 v62.5,25 | 60.13,20.64 v61,21.5 | v61,21.5 61.11,21.19 60.47,20.97 60.69,21.61 v61,21.5 | v62.5,25 62.45,24.68 61.78,24.78 62.28,25.24 v62.5,25
N$5
  Bottom 0.25: U2.7 32.5,16 31.5,17 27.5,17
  Bottom 1: L1.2 27.5,18.9 27.5,17 D1.A
N$6
  Bottom 0.25: U2.2 31.5,20.25 R12.2 | L1.1 28,21
  Bottom 0.6: 28,21 R12.2
N$7
  Bottom 0.25: U2.10 31,14.6 29.75,14.6 29,13.85 29,12.3 29.5,11.8 R21.2
N$8
  Bottom 0.25: U1.4 65.75,23.25 R7.2 R1.1 R8.2 67.55,19 Q3.3
N$9
  Bottom 0.25: R18.2 R20.2 34,13.3 34,16 32.5,17.5 U2.4
N$10
  Bottom 0.25: R21.1 C6.2
N$11
  Bottom 0.25: U2.1 31,19.5 30.4,19.5 29.9,20 26,20 25.5,19.5 25.5,17.5 25,17 R17.1 R19.2
N$12
  Bottom 0.25: X3.12 62.38,39.98 61.5,39.1 R40.1
N$13
  Bottom 0.25: U1.5 64.8,22.75 64.9,22.65 64.9,21.95 65.3,21.55 R8.1
N$14  (via drill 0.5)
  Top 0.25: v39.5,37 41,37 44.4,40.4 44.4,42.15 v45.25,43 | v45.25,43 45.36,42.69 44.72,42.47 44.94,43.11 v45.25,43 | v39.5,37 39.64,37.3 40.25,37 39.64,36.7 v39.5,37
  Bottom 0.25: v45.25,43 R42.2 | U5.53 39.75,36.75 v39.5,37 | v45.25,43 45.39,43.3 46,43 45.39,42.7 v45.25,43 | v39.5,37 39.73,37.23 40.21,36.75 39.54,36.67 v39.5,37
N$15
  Bottom 0.25: R37.1 R38.1 C9.2
N$16
  Bottom 0.25: R33.2 56.3,33.2 56,33.5 55,33.5 54.75,33.75 | C8.2 54.7,33.8 54.75,33.75 | X3.3 53.09,33.09 53.5,33.5 54.5,33.5 54.75,33.75 | R33.2 R32.2 | R33.2 FB1.2
N$17
  Bottom 0.25: X3.9 63.9,29.9 64.5,30.5 R39.1
N$18
  Bottom 0.25: U5.39 36.75,45.05 38,46.3 38,48.6 36.4,50.2 XTAL.3 34.4,50.2 34.1,49.9 C11.2
N$19
  Bottom 0.25: C16.2 | C16.2 41.9,48.1 41.6,47.8 40.2,47.8 XTAL.1 39.6,47.8 39.5,47.8 38.5,46.8 38.5,46 37.25,44.75 U5.40
N$20
  Bottom 0.6: Q5.2 X1.5 53,65 53,62 53.45,61.55 Q5.3
N$21
  Bottom 0.6: Q6.2 X1.7 46,65 46,62 46.45,61.55 Q6.3
N$22
  Bottom 0.6: Q7.2 X1.9 39,65 39,62 39.45,61.55 Q7.3
N$23
  Bottom 0.25: Q5.6 51.55,56.65 R4.1
N$24
  Bottom 0.25: Q6.6 44.55,56.65 R5.1
N$25
  Bottom 0.25: Q7.6 37.55,56.65 R6.1
N$26  (via drill 0.5)
  Top 0.25: v37.25,31.75 35.85,31.75 34.5,33.1 34.5,33.75 34,34.25 33,34.25 32.5,33.75 32.5,32.25 29.25,29 27,29 25.5,30.5 25.5,32.5 26.5,33.5 29.75,33.5 30.25,34 30.25,35.5 29.75,36 28,36 26.75,37.25 26.75,40.75 25,42.5 v22.5,42.5 | v37.25,31.75 37.11,31.45 36.5,31.75 37.11,32.05 v37.25,31.75 | v22.5,42.5 22.64,42.8 23.25,42.5 22.64,42.2 v22.5,42.5
  Bottom 0.25: U5.8 37.75,31.25 v37.25,31.75 | v22.5,42.5 R41.2 | v37.25,31.75 37.57,31.84 37.75,31.19 37.13,31.45 v37.25,31.75 | v22.5,42.5 22.2,42.64 22.5,43.25 22.8,42.64 v22.5,42.5
N$29
  Bottom 1.5: X2.1 FUSE1.1
N$30
  Bottom 0.25: Q1.4 46.5,12.6 R28.2 47.4,10.8 48.7,9.5 Q8.3
N$31
  Bottom 1.5: X2.3 45.5,7 44.4,8.1 FUSE2.1
N$32
  Bottom 0.25: Q8.1 52.85,10.45 R29.1 53.9,10.3 54.7,9.5 Q9.3
N$33
  Bottom 0.25: D2.A 59.1,9.9 58.55,10.45 Q9.1
N$34
  Bottom 0.25: U6.3 21.98,33.02 22.8,32.2 C12.2
N$35  (via drill 0.5)
  Top 0.25: v16.5,46.75 LED1.A | v16.5,46.75 16.2,46.89 16.5,47.5 16.8,46.89 v16.5,46.75
  Bottom 0.25: R9.1 v16.5,46.75 | v16.5,46.75 16.8,46.61 16.5,46 16.2,46.61 v16.5,46.75
N$36  (via drill 0.5)
  Top 0.25: v19.5,46.75 LED2.A | v19.5,46.75 19.2,46.89 19.5,47.5 19.8,46.89 v19.5,46.75
  Bottom 0.25: R10.1 v19.5,46.75 | v19.5,46.75 19.8,46.61 19.5,46 19.2,46.61 v19.5,46.75
N$37
  Bottom 0.25: U8.13 12.68,59.33 9.5,62.5 8.5,62.5 7,64 X4.8
N$38  (via drill 0.5)
  Top 0.25: v22.5,46.75 LED3.A | v22.5,46.75 22.2,46.89 22.5,47.5 22.8,46.89 v22.5,46.75
  Bottom 0.25: R41.1 v22.5,46.75 | v22.5,46.75 22.8,46.61 22.5,46 22.2,46.61 v22.5,46.75
N$39
  Bottom 0.25: U8.14 13.03,59.98 10.5,62.5 X4.7
N$40
  Bottom 0.25: U8.15 13.38,60.62 13,61 13,63.5 14,64.5 X4.6
N$41
  Bottom 0.25: U8.12 12.32,58.67 9.5,61.5 8,61.5 7,62.5 5,62.5 3.5,64 X4.9
N$42
  Bottom 0.25: U8.1 19.23,61.27 17.5,63 X4.5
N$43
  Bottom 0.25: U8.5 22.18,58.67 28,64.5 X4.2
N$44
  Bottom 0.25: U8.2 21.62,60.62 22,61 22,63.5 21,64.5 X4.4
N$45
  Bottom 0.25: U8.4 21.82,59.33 24.5,62 X4.3
N$46
  Bottom 0.25: U9.13 12.18,30.18 11,29 11,27.5 8,24.5 X5.8
N$47
  Bottom 0.25: U9.14 11.53,30.52 9,28 X5.7
N$48
  Bottom 0.25: U9.15 10.88,30.88 10.5,30.5 8,30.5 7,31.5 X5.6
N$49
  Bottom 0.25: U9.12 12.82,29.82 11.5,28.5 11.5,27 9,24.5 9,23 7,21 X5.9
N$50
  Bottom 0.25: U9.5 12.82,39.67 7,45.5 X5.2
N$51
  Bottom 0.25: U9.1 10.22,36.92 8.3,35 X5.5
N$52
  Bottom 0.25: U9.2 10.88,39.12 10.5,39.5 8,39.5 7,38.5 X5.4
N$53
  Bottom 0.25: U9.4 12.18,39.33 9.5,42 X5.3
N$54
  Bottom 0.25: U10.13 22.32,10.68 25.5,7.5 26.5,7.5 28,6 X6.8
N$55
  Bottom 0.25: U10.14 21.98,10.03 24.5,7.5 X6.7
N$56
  Bottom 0.25: U10.15 21.62,9.38 22,9 22,7 21,6 X6.6
N$57
  Bottom 0.25: U10.12 22.68,11.32 25.5,8.5 26.5,8.5 27.5,7.5 30,7.5 31.5,6 X6.9
N$58
  Bottom 0.25: U10.5 12.82,11.32 7,5.5 X6.2
N$59
  Bottom 0.25: U10.1 15.78,8.72 17.5,7 X6.5
N$60
  Bottom 0.25: U10.2 13.38,9.38 13,9 13,7 14,6 X6.4
N$61
  Bottom 0.25: X6.3 10.5,8 13.18,10.68 U10.4
N$63
  Bottom 0.25: SW1.4 17.3,23.76 R35.1 R36.2 21.7,23.76 SW1.3
N$64
  Bottom 0.25: U6.7 21.82,35.62 22.2,36 C14.2
N$65
  Bottom 0.25: U6.2 20.38,32.38 19.7,31.7 C13.2
N$66
  Bottom 0.25: U6.4 20.18,33.67 19.8,33.3 C13.1
N$67
  Bottom 0.25: U6.5 20.18,34.33 19.8,34.7 C15.2
N$68
  Bottom 0.25: U6.6 21.06,35 20.5,35 19.2,36.3 C15.1
N$69  (via drill 0.5)
  Top 0.25: v44,13 46,11 51,11 52,12 52,14 53,15 58.5,15 59,14.5 59,8.25 v57.75,7 | v44,13 44.31,13.11 44.53,12.47 43.89,12.69 v44,13 | v57.75,7 57.64,7.31 58.28,7.53 58.06,6.89 v57.75,7
  Bottom 0.25: 42.5,13 v44,13 | D2.K 61.9,7.9 61.5,7.5 58.25,7.5 v57.75,7 | v44,13 43.86,12.71 43.25,13 43.86,13.29 v44,13 | v57.75,7 57.66,7.32 58.31,7.5 58.05,6.88 v57.75,7
  Bottom 0.5: Q1.6 42.13,13.87 42.5,13.5 42.5,13
  Bottom 1: 42.5,13 42.09,12.6 Q1.5 41.6,12.2 FUSE2.2
N$71
  Bottom 0.25: U4.2 47.12,27.18 47.3,27 47.3,26.7 | U4.1 47.12,26.52 47.3,26.7 | R27.1 47.7,26.3 47.3,26.7
N$72
  Bottom 0.25: C7.2 52.5,27.5 52.17,27.82 U4.6
OUT_1  (via drill 0.5)
  Top 0.25: v50,51 v50,58 | v50,51 49.7,51.14 50,51.75 50.3,51.14 v50,51 | v50,58 50.3,57.86 50,57.25 49.7,57.86 v50,58
  Bottom 0.25: Q5.5 52.5,59.2 52.2,59.5 50.3,59.5 R14.2 v50,58 | U5.44 39.25,41.95 38.5,42.7 38.5,44.5 39.5,45.5 43,45.5 45,47.5 49,47.5 50,48.5 v50,51 | v50,51 50.3,50.86 50,50.25 49.7,50.86 v50,51 | v50,58 49.7,58.14 50,58.75 50.3,58.14 v50,58
OUT_2  (via drill 0.5)
  Top 0.25: v44,51 44,53.5 43,54.5 v43,58 | v44,51 43.7,51.14 44,51.75 44.3,51.14 v44,51 | v43,58 43.3,57.86 43,57.25 42.7,57.86 v43,58
  Bottom 0.25: Q6.5 45.5,59.2 45.2,59.5 43.3,59.5 R15.2 v43,58 | U5.43 38.75,41.75 38,42.5 38,44.8 39.2,46 42.5,46 44,47.5 v44,51 | v44,51 44.3,50.86 44,50.25 43.7,50.86 v44,51 | v43,58 42.7,58.14 43,58.75 43.3,58.14 v43,58
OUT_3  (via drill 0.5)
  Top 0.25: v35.5,38 35,38.5 35,52.5 37,54.5 37,57 v36,58 | v35.5,38 35.18,37.91 35,38.56 35.62,38.3 v35.5,38 | v36,58 36.31,58.11 36.53,57.47 35.89,57.69 v36,58
  Bottom 0.25: Q7.5 38.5,59.2 38.2,59.5 36.3,59.5 R16.2 v36,58 | U5.29 34.75,37.25 v35.5,38 | v35.5,38 35.61,37.69 34.97,37.47 35.19,38.11 v35.5,38 | v36,58 35.7,58.14 36,58.75 36.3,58.14 v36,58
PGC  (via drill 0.5)
  Top 0.25: v38.75,39 41,41.25 41,43.2 43.6,45.8 47.7,45.8 56.5,37 62.2,37 63.2,36 65.5,36 67,34.5 67,19.75 65.25,18 62.25,18 60,15.75 60,11 63,8 X2.8 | v38.75,39 38.64,39.31 39.28,39.53 39.06,38.89 v38.75,39
  Bottom 0.25: U5.42 38.25,39.5 v38.75,39 | v38.75,39 38.43,38.91 38.25,39.56 38.87,39.3 v38.75,39
PGD  (via drill 0.5)
  Top 0.25: v36.75,39.25 38,40.5 39.4,40.5 40.5,41.6 40.5,43.5 43.5,46.5 48,46.5 57,37.5 62.5,37.5 63.5,36.5 65.75,36.5 67.5,34.75 67.5,19.5 65.5,17.5 62.5,17.5 60.5,15.5 60.5,11.5 66.5,5.5 X2.9 | v36.75,39.25 36.64,39.56 37.28,39.78 37.06,39.14 v36.75,39.25
  Bottom 0.25: v36.75,39.25 36.3,39.25 35.75,39.8 U5.37 | v36.75,39.25 36.51,39.02 36.05,39.51 36.72,39.58 v36.75,39.25
REV_PROT_GATE
  Bottom 0.25: Q1.2 44.87,15.13 43.4,16.6 43.4,17.15 42.9,17.65 R3.2
RS323-RXD  (via drill 0.5)
  Top 0.25: v20.5,37 20.5,26.3 19,24.8 19,13.25 24.75,7.5 52,7.5 52.5,7 X2.5 | v20.5,37 20.8,36.86 20.5,36.25 20.2,36.86 v20.5,37
  Bottom 0.25: U6.8 20.5,36.27 v20.5,37 | v20.5,37 20.82,36.94 20.69,36.27 20.25,36.78 v20.5,37
RS323-TXD  (via drill 0.5)
  Top 0.25: v23.5,34.5 22,34.5 21,33.5 21,26 19.5,24.5 19.5,13.5 25,8 55,8 56,7 X2.6 | v23.5,34.5 23.36,34.2 22.75,34.5 23.36,34.8 v23.5,34.5
  Bottom 0.25: U6.13 24.32,33.67 v23.5,34.5 | v23.5,34.5 23.81,34.61 24.03,33.97 23.39,34.19 v23.5,34.5
RXD
  Bottom 0.25: U5.32 31.2,38.75 30.95,39 27,39 26,38 26,36.5 26.23,36.27 U6.9
SCK
  Bottom 0.25: U5.34 34.25,42.25 33.5,43 31,43 30.14,42.13 U7.6
SDI  (via drill 0.5)
  Top 0.25: v29,44.5 v33,44.5 | v29,44.5 29.14,44.8 29.75,44.5 29.14,44.2 v29,44.5 | v33,44.5 32.86,44.2 32.25,44.5 32.86,44.8 v33,44.5
  Bottom 0.25: U7.2 28.86,44.63 v29,44.5 | U5.35 34.75,42.75 v33,44.5 | v29,44.5 28.68,44.59 28.86,45.24 29.26,44.69 v29,44.5 | v33,44.5 33.31,44.61 33.53,43.97 32.89,44.19 v33,44.5
SDO
  Bottom 0.25: U5.36 35.25,39.75 34.9,39.4 33.5,39.4 32.19,40.71 U7.5
SLA  (via drill 0.5)
  Top 0.25: v62.5,22 62.5,21.5 59.5,18.5 54.5,18.5 52.5,16.5 51,16.5 | v49.5,12 50.5,13 50.5,16 51,16.5 | 51,16.5 50.5,17 50.5,23.5 50,24 50,26.3 v49.3,27 | v62.5,22 62.74,21.78 62.28,21.28 62.18,21.95 v62.5,22 | v49.5,12 49.39,12.31 50.03,12.53 49.81,11.89 v49.5,12 | v49.3,27 49.61,27.11 49.83,26.47 49.19,26.69 v49.3,27
  Top 1: v55,12 v56.5,13.5 | 26,11 v26,12 | v26,12 v24,12 25,11 | v26,10 25,11 | 26,11 25,11 | 28,10 27,11 | v26,12 27,11 | 26,11 27,11
  Top 1.016: v55,12 v56.5,12 v56.5,13.5 55,13.5 v55,12 | v55,12 53,10 28,10 v26,10 26,11
  Bottom 0.25: C1.2 27.5,9.8 | R17.2 26.8,13.7 27.5,13 D1.K | U1.7 61.25,23.25 v62.5,22 | v49.5,12 50,12.5 50,13.6 R24.2 | v49.3,27 R27.2 | v49.3,27 49.48,27.18 U4.7 51.42,27.18 51.6,27 51.6,26.1 51.85,25.85 C7.1 | v62.5,22 62.19,21.89 61.97,22.53 62.61,22.31 v62.5,22 | v49.5,12 49.38,12.3 50,12.56 49.82,11.91 v49.5,12 | v49.3,27 49.59,26.86 49.3,26.25 49.01,26.86 v49.3,27 | v49.3,27 49.37,27.32 50.03,27.18 49.51,26.75 v49.3,27
  Bottom 0.6: R24.2 51.51,12.6 Q4.1 55,12.6 | 55,12.6 55.59,12.6 55.91,12.6 | v55,12 55,12.6 | v55,12 54.86,11.93 54.54,12.6 55.1,12.12 v55,12 | v55,12 54.9,12.12 55.46,12.6 55.14,11.93 v55,12
  Bottom 1: 27.5,9.8 27.5,10 | 27.5,10 27.5,11 | 27.5,11 27.5,12 | 27.5,12 D1.K | 55.59,12.6 v56.5,13.5 v56.5,12 | v56.5,12 55.91,12.6 | v55,12 v56.5,12 | 27.5,10 v26,10 | v26,10 v26,12 | v26,12 v24,12 25,11 | v26,10 25,11 | v26,12 27.5,12 | 27.5,11 25,11
SLA_CURRENT
  Bottom 0.25: U4.4 45.48,28.48 R31.2 43.95,28.95 43.5,28.5 43.5,26.5 43,26 35.75,26 35.25,26.5 U5.13
SLA_VOLTAGE  (via drill 0.5)
  Top 0.25: v41.3,21.5 38.8,24 34,24 v33,25 | v33,25 33.31,25.11 33.53,24.47 32.89,24.69 v33,25 | v41.3,21.5 40.99,21.39 40.77,22.03 41.41,21.81 v41.3,21.5
  Bottom 0.25: R30.2 R26.1 v41.3,21.5 | v33,25 33,25.7 34.75,27.45 U5.14 | v33,25 32.72,25.16 33.05,25.75 33.3,25.12 v33,25 | v41.3,21.5 41.59,21.36 41.3,20.75 41.01,21.36 v41.3,21.5
SW_3V3
  Bottom 0.6: U3.7 33.13,54.37 33.3,54.2 L2.1
SWITCH_TO_BAT  (via drill 0.5)
  Top 0.25: v62,19.5 63.5,21 63.5,23 64,23.5 64,26 63.5,26.5 61.2,26.5 59.7,25 54.5,25 50,29.5 v48,29.5 | v62,19.5 61.89,19.81 62.53,20.03 62.31,19.39 v62,19.5 | v48,29.5 48.14,29.8 48.75,29.5 48.14,29.2 v48,29.5
  Bottom 0.25: Q3.1 63.65,18.05 R2.2 62.3,18.2 62,18.5 v62,19.5 | U5.64 44.25,31.25 45,30.5 47,30.5 v48,29.5 | v62,19.5 62.3,19.36 62,18.75 61.7,19.36 v62,19.5 | v48,29.5 47.69,29.39 47.47,30.03 48.11,29.81 v48,29.5
SYNC_3V3  (via drill 0.5)
  Top 0.25: v33.9,38.1 34.5,38.7 34.5,52.7 36.5,54.7 36.5,56.5 36,57 34.5,57 33,58.5 v31.3,58.5 | v31.3,58.5 31.44,58.8 32.05,58.5 31.44,58.2 v31.3,58.5 | v33.9,38.1 33.79,38.41 34.43,38.63 34.21,37.99 v33.9,38.1
  Bottom 0.25: 31.55,56.91 U3.5 v31.29,58.49 v31.3,58.5 | v31.3,58.5 R25.2 | U5.30 33.55,37.75 v33.9,38.1 | v31.3,58.5 31.16,58.2 30.55,58.5 31.16,58.8 v31.3,58.5 | v31.3,58.5 31.59,58.35 31.29,57.75 31,58.36 v31.3,58.5 | v33.9,38.1 33.91,37.77 33.24,37.75 33.63,38.29 v33.9,38.1
TPIN+
  Bottom 0.25: U5.47 40.75,39.75 41,39.5 41.6,39.5 43.75,41.65 43.75,43.8 44.45,44.5 49.5,44.5 51.5,42.5 51.5,39.33 X3.7 53.48,39 R37.2
TPIN-
  Bottom 0.25: U5.46 40.25,39.45 40.7,39 41.9,39 44.25,41.35 44.25,43.5 44.75,44 49,44 50.11,42.89 X3.8 50.11,38.89 52,37 54.2,37 R38.2
TPOUT+
  Bottom 0.25: U5.51 44.3,37.75 45.3,38.75 47.55,38.75 48.1,38.2 48.1,31.9 49.45,30.55 X3.1 53.55,30.55 54,31 R32.1
TPOUT-
  Bottom 0.25: U5.50 44.05,38.25 45.05,39.25 47.95,39.25 48.7,38.5 48.7,32.5 49.38,31.82 X3.2 53.33,31.82 54,32.5 R33.1
TXD
  Bottom 0.25: U6.11 26.02,34.98 25.5,35.5 25.5,38.5 26.5,39.5 32.6,39.5 33,39.1 33,38.5 32.75,38.25 U5.31
V+  (via drill 0.5)
  Top 0.25: v35.05,56.1 34.4,56.1 33,57.5 27,57.5 25.7,56.2 v25.7,52.1 | v25.7,52.1 25.41,52.24 25.7,52.85 26,52.24 v25.7,52.1 | v35.05,56.1 34.87,55.83 34.31,56.19 34.94,56.41 v35.05,56.1
  Bottom 0.25: 57.5,24.5 58.95,24.5 59.7,23.75 U1.8 | U3.2 25.71,53.11 U3.1 25.71,53.01 25.7,53 v25.7,52.1 | v25.7,52.1 25.41,52.24 25.7,52.85 26,52.24 v25.7,52.1
  Bottom 0.6: Q6.4 46.45,56.65 R5.2 46.5,56.3 46.5,54.5 | Q7.4 39.45,56.65 R6.2 39.5,56.3 39.5,55.2 40.2,54.5 | Q5.4 53.45,56.65 R4.2 53.5,56.3 53.5,54.5 | C3.2 33.5,56 33.13,55.63 U3.6 | Q2.3 57.63,19.36 57.5,19.5 | Q2.1 57.59,21.91 57.5,22 | Q4.3 55.13,15.13
  Bottom 1: 66,27 65.5,26.5 59.5,26.5 57.5,24.5 57.5,22 57.5,19.5 57.5,18 56,16.5 56,16 55.13,15.13 | C3.2 v35.05,56.1 35.65,56.1 37.25,54.5 40,54.5
  Bottom 2: X1.3 59.5,61.5 57,59 57,54.5 | 57,54.5 53.5,54.5 46.5,54.5 40.2,54.5 40,54.5 | 57,54.5 57,52 59,50 65,50 67,48 67,44.5 67,28 66,27
VFB_3V3
  Bottom 0.25: U3.3 24.93,55.63 24.75,55.45 R23.2 R22.1 C4.1

## Text on the board
tPlace: MAINS | ONBAT | STAT | Alarm Station | Rev A1 | May/2009